# Altium schematic sheet TLV751_PINOUT.SchDoc
size B; SheetNumber: 3; SheetTotal: 3
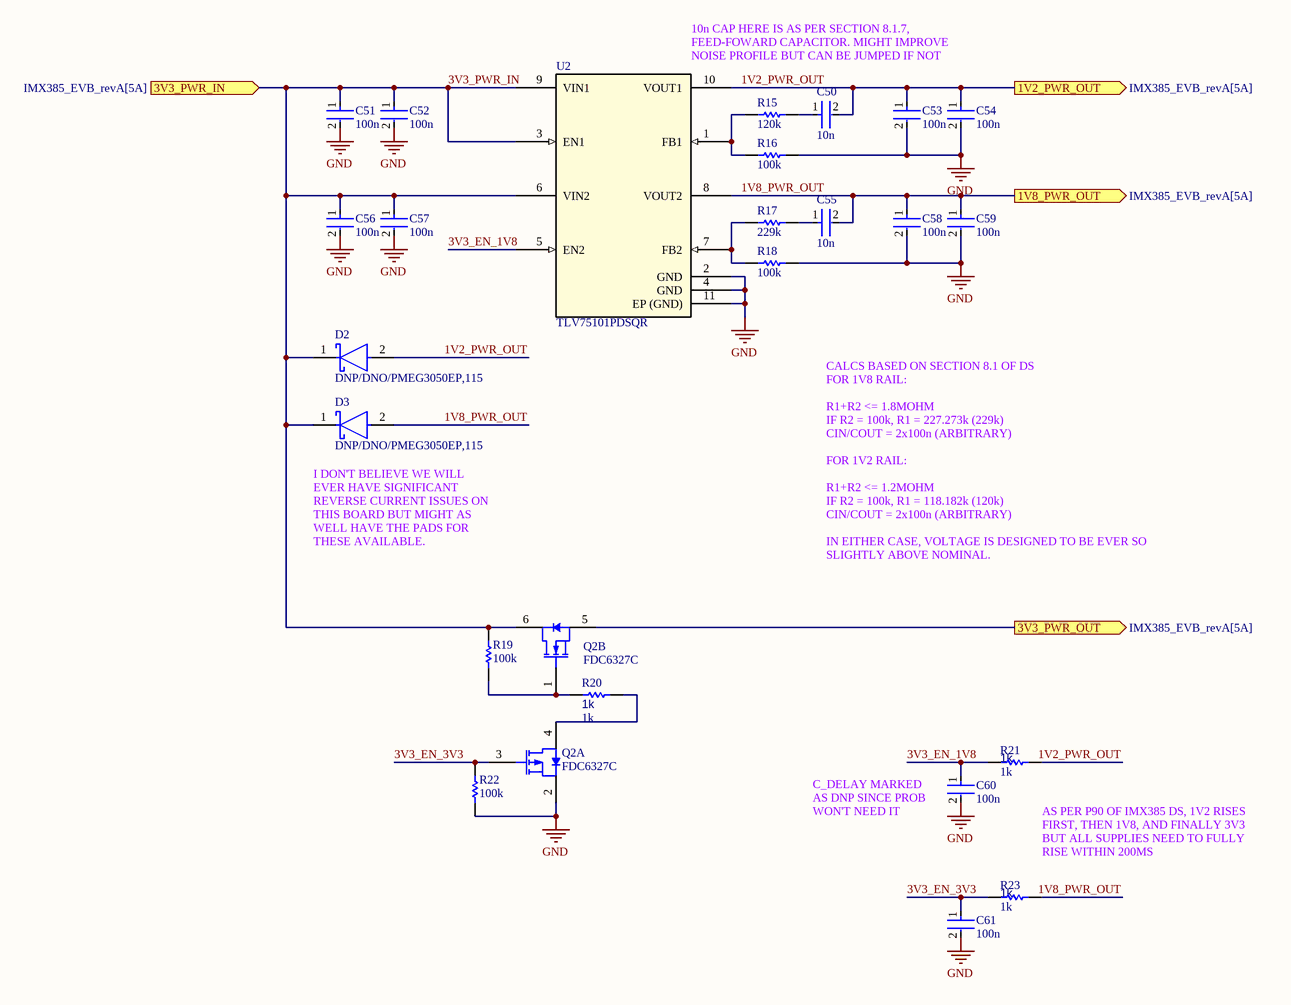
[diagram p0: TLV751_PINOUT.SchDoc]

## Parts
C50  10n  [FP-0402-L_1_0_0_05-W_0_5-IPC_A]
C51  100n  [FP-0402-L_1_0_0_05-W_0_5-IPC_A]
C52  100n  [FP-0402-L_1_0_0_05-W_0_5-IPC_A]
C53  100n  [FP-0402-L_1_0_0_05-W_0_5-IPC_A]
C54  100n  [FP-0402-L_1_0_0_05-W_0_5-IPC_A]
C55  10n  [FP-0402-L_1_0_0_05-W_0_5-IPC_A]
C56  100n  [FP-0402-L_1_0_0_05-W_0_5-IPC_A]
C57  100n  [FP-0402-L_1_0_0_05-W_0_5-IPC_A]
C58  100n  [FP-0402-L_1_0_0_05-W_0_5-IPC_A]
C59  100n  [FP-0402-L_1_0_0_05-W_0_5-IPC_A]
C60  100n  [FP-0402-L_1_0_0_05-W_0_5-IPC_A]
C61  100n  [FP-0402-L_1_0_0_05-W_0_5-IPC_A]
D2  DNP/DNO/PMEG3050EP,115  [FP-SOD128-MFG]
D3  DNP/DNO/PMEG3050EP,115  [FP-SOD128-MFG]
Q2  FDC6327C  [FAIR-SOT23-6_V]  (parts A,B of 2)
R15  120k  [R0603B]
R16  100k  [R0603B]
R17  229k  [R0603B]
R18  100k  [R0603B]
R19  100k  [R0603B]
R20  1k  [R0603B]
R21  1k  [R0603B]
R22  100k  [R0603B]
R23  1k  [R0603B]
U2  TLV75101PDSQR  [TLV75101PDSQR-Footprint-1]

## Ports
1V2_PWR_OUT (out, see IMX385_EVB_revA[5A]), 1V8_PWR_OUT (out, see IMX385_EVB_revA[5A]), 3V3_PWR_IN (in, see IMX385_EVB_revA[5A]), 3V3_PWR_OUT (out, see IMX385_EVB_revA[5A])

## Nets
GND: C51.2 C52.2 C53.2 C54.2 C56.2 C57.2 C58.2 C59.2 C60.2 C61.2 Q2.2(S) R16.1 R18.1 R22.2 U2.2(GND) U2.4(GND) U2.11(EP_(GND))
1V2_PWR_OUT: C50.2 C53.1 C54.1 D2.2(A) R21.1 U2.10(VOUT1) ; port 1V2_PWR_OUT
1V8_PWR_OUT: C55.2 C58.1 C59.1 D3.2(A) R23.1 U2.8(VOUT2) ; port 1V8_PWR_OUT
3V3_EN_1V8: C60.1 R21.2 U2.5(EN2)
3V3_EN_3V3: C61.1 Q2.3(G) R22.1 R23.2
3V3_PWR_IN: C51.1 C52.1 C56.1 C57.1 D2.1(C) D3.1(C) Q2.6(D) R19.1 U2.3(EN1) U2.6(VIN2) U2.9(VIN1) ; port 3V3_PWR_IN
3V3_PWR_OUT: Q2.5(S) ; port 3V3_PWR_OUT
NetC50_1: C50.1 R15.1
NetC55_1: C55.1 R17.1
NetQ2_1: Q2.1(G) R19.2 R20.1
NetQ2_4: Q2.4(D) R20.2
NetR15_2: R15.2 R16.2 U2.1(FB1)
NetR17_2: R17.2 R18.2 U2.7(FB2)

## Notes on the sheet
- (near U2) 10n CAP HERE IS AS PER SECTION 8.1.7, FEED-FOWARD CAPACITOR. MIGHT IMPROVE NOISE PROFILE BUT CAN BE JUMPED IF NOT
- (near D3) I DON'T BELIEVE WE WILL EVER HAVE SIGNIFICANT REVERSE CURRENT ISSUES ON THIS BOARD BUT MIGHT AS WELL HAVE THE PADS FOR THESE AVAILABLE.
- CALCS BASED ON SECTION 8.1 OF DS
  FOR 1V8 RAIL:
  R1+R2 <= 1.8MOHM
  IF R2 = 100k, R1 = 227.273k (229k)
  CIN/COUT = 2x100n (ARBITRARY)
  FOR 1V2 RAIL:
  R1+R2 <= 1.2MOHM
  IF R2 = 100k, R1 = 118.182k (120k)
  CIN/COUT = 2x100n (ARBITRARY)
  IN EITHER CASE, VOLTAGE IS DESIGNED TO BE EVER SO SLIGHTLY ABOVE NOMINAL.
- (near C60) C_DELAY MARKED AS DNP SINCE PROB WON'T NEED IT
- AS PER P90 OF IMX385 DS, 1V2 RISES FIRST, THEN 1V8, AND FINALLY 3V3 BUT ALL SUPPLIES NEED TO FULLY RISE WITHIN 200MS

## Library data of the parts
C50-C61 = CMP-001-00058-1: LARGE PADS, 0402 CAP, CHANGE COMMENT TO MATCH REAL P/N; Capacitor Type: Ceramic; Min Operating Temperature: -55°C; Mounting Technology: Surface Mount; Pins: 2; Case/Package: 0402; RoHS Compliant: Yes; Max Operating Temperature: 85°C
D2 D3 = CMP-14398-000051-1: DIODE SCHOTTKY 30V 5A SOD128; RoHS Compliant: Yes
Q2 = CMP-2000-04939-1: Dual N & P-Channel 2.5 V Specified PowerTrench(TM) MOSFET, -55 to 150 degC, 6-Pin SOT-23, RoHS, Tape and Reel; Manufacturer: Fairchild; Typical Rise Time: 9@NChannel; Rad Hard: No; Maximum Drain Source Voltage: 20V; Typical Fall Time: 3@NChannel; Typical Turn-On Delay Time: 5@NChannel; Maximum Continuous Drain Current: 2.7@NChannel; Typical Turn-Off Delay Time: 12@NChannel; RDS-on: 80@4.5V@NChannel; Channel Mode: Enhancement; Maximum Gate Source Voltage: ±8V; Package Version: Rev. 5, 05/2015; Operating Temperature: -55to150degC; Packaging: Tape&Reel; Package Reference: SOT23-6; Package URL: https://www.fairchildsemi.com/package-drawings/MA/MA06A.pdf; Package Description: 6-Pin Small Outline Transistor, Body 2.9 x 1.6 mm, Pitch 0.95 mm; Manufacturer URL: https://www.fairchildsemi.com/; Channel Type: N; Datasheet Version: Rev. E, 07/2000; Package: 6SuperSOT; Datasheet URL: https://www.fairchildsemi.com/datasheets/FD/FDC6327C.pdf; Mounting: SurfaceMount; Category: MOSFET
R15-R23 = CMP-009-00002-14: Resistor
  R15: Value: 120k
  R16 R18 R19 R22: Value: 100k
  R17: Value: 229k
  R20 R21 R23: Value: 1k
U2 = CMP-019-00062-2: 500-mA, low-IQ, high-PSRR, dual-channel low-dropout (LDO) voltage regulator 10-WSON -40 to 125; Pins: 10